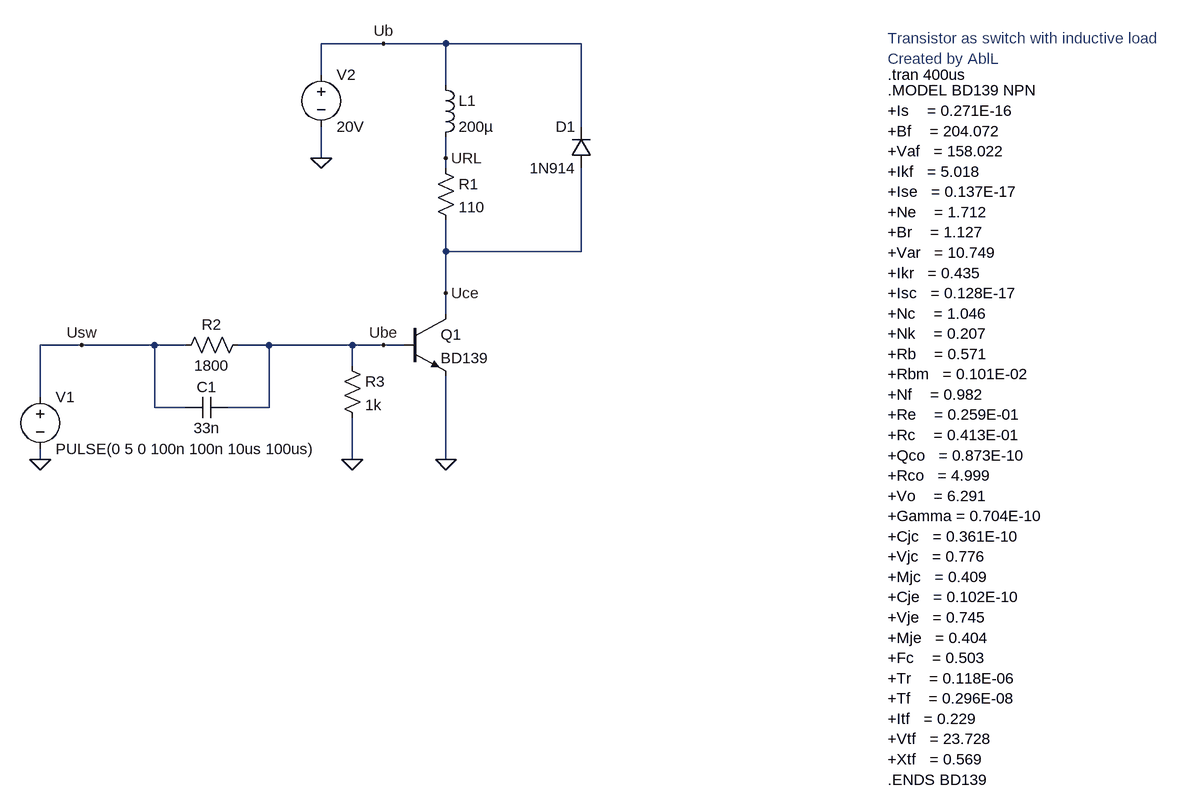
[diagram p0: schematic Transistor_Schalter_mit_ind_Last.asc]
Transistor_Schalter_mit_ind_Last.asc, the LTspice schematic file:
Version 4
SHEET 1 1312 880
WIRE 64 -160 -32 -160
WIRE 160 -160 64 -160
WIRE 368 -160 160 -160
WIRE -32 -112 -32 -160
WIRE 160 -96 160 -160
WIRE 368 -32 368 -160
WIRE -32 16 -32 -32
WIRE 160 16 160 -16
WIRE 160 32 160 16
WIRE 160 160 160 112
WIRE 368 160 368 32
WIRE 368 160 160 160
WIRE 160 224 160 160
WIRE 160 256 160 224
WIRE -400 304 -464 304
WIRE -288 304 -400 304
WIRE -240 304 -288 304
WIRE -112 304 -160 304
WIRE 16 304 -112 304
WIRE 64 304 16 304
WIRE 96 304 64 304
WIRE 16 336 16 304
WIRE -464 384 -464 304
WIRE -288 400 -288 304
WIRE -240 400 -288 400
WIRE -112 400 -112 304
WIRE -112 400 -176 400
WIRE -464 480 -464 464
WIRE 16 480 16 416
WIRE 160 480 160 352
FLAG -464 480 0
FLAG 160 480 0
FLAG -32 16 0
FLAG 160 224 Uce
FLAG 64 304 Ube
FLAG -400 304 Usw
FLAG 16 480 0
FLAG 64 -160 Ub
FLAG 160 16 URL
SYMBOL res 144 16 R0
SYMATTR InstName R1
SYMATTR Value 110
SYMBOL cap -176 384 R90
WINDOW 0 0 32 VBottom 2
WINDOW 3 32 32 VTop 2
SYMATTR InstName C1
SYMATTR Value 33n
SYMBOL res -144 288 R90
WINDOW 0 0 56 VBottom 2
WINDOW 3 32 56 VTop 2
SYMATTR InstName R2
SYMATTR Value 1800
SYMBOL voltage -464 368 R0
SYMATTR InstName V1
SYMATTR Value PULSE(0 5 0 100n 100n 10us 100us)
SYMBOL voltage -32 -128 R0
WINDOW 123 0 0 Left 0
WINDOW 39 0 0 Left 0
SYMATTR InstName V2
SYMATTR Value 20V
SYMBOL npn 96 256 R0
SYMATTR InstName Q1
SYMATTR Value BD139
SYMBOL ind 144 -112 R0
SYMATTR InstName L1
SYMATTR Value 200µ
SYMBOL diode 384 32 R180
WINDOW 0 24 64 Left 2
WINDOW 3 24 0 Left 2
SYMATTR InstName D1
SYMATTR Value 1N914
SYMBOL res 0 320 R0
SYMATTR InstName R3
SYMATTR Value 1k
TEXT 840 -88 Left 2 !.MODEL BD139 NPN\n+Is    = 0.271E-16\n+Bf    = 204.072\n+Vaf   = 158.022\n+Ikf   = 5.018\n+Ise   = 0.137E-17\n+Ne    = 1.712\n+Br    = 1.127\n+Var   = 10.749\n+Ikr   = 0.435\n+Isc   = 0.128E-17\n+Nc    = 1.046\n+Nk    = 0.207\n+Rb    = 0.571\n+Rbm   = 0.101E-02\n+Nf    = 0.982\n+Re    = 0.259E-01\n+Rc    = 0.413E-01\n+Qco   = 0.873E-10\n+Rco   = 4.999\n+Vo    = 6.291\n+Gamma = 0.704E-10\n+Cjc   = 0.361E-10\n+Vjc   = 0.776\n+Mjc   = 0.409\n+Cje   = 0.102E-10\n+Vje   = 0.745\n+Mje   = 0.404\n+Fc    = 0.503\n+Tr    = 0.118E-06\n+Tf    = 0.296E-08\n+Itf   = 0.229\n+Vtf   = 23.728\n+Xtf   = 0.569\n.ENDS BD139
TEXT 840 -168 Left 2 ;Transistor as switch with inductive load\nCreated by AblL
TEXT 840 -112 Left 2 !.tran 400us

The netlist it stands for:
* Transistor_Schalter_mit_ind_Last.asc
R1 URL Uce 110
C1 Ube Usw 33n
R2 Ube Usw 1800
V1 Usw 0 PULSE(0 5 0 100n 100n 10us 100us)
V2 Ub 0 20V
Q1 Uce Ube 0 0 BD139
L1 Ub URL 200µ
D1 Uce Ub 1N914
R3 Ube 0 1k
.model D D
.lib standard.dio
.model NPN NPN
.model PNP PNP
.lib standard.bjt
.MODEL BD139 NPN
+Is    = 0.271E-16
+Bf    = 204.072
+Vaf   = 158.022
+Ikf   = 5.018
+Ise   = 0.137E-17
+Ne    = 1.712
+Br    = 1.127
+Var   = 10.749
+Ikr   = 0.435
+Isc   = 0.128E-17
+Nc    = 1.046
+Nk    = 0.207
+Rb    = 0.571
+Rbm   = 0.101E-02
+Nf    = 0.982
+Re    = 0.259E-01
+Rc    = 0.413E-01
+Qco   = 0.873E-10
+Rco   = 4.999
+Vo    = 6.291
+Gamma = 0.704E-10
+Cjc   = 0.361E-10
+Vjc   = 0.776
+Mjc   = 0.409
+Cje   = 0.102E-10
+Vje   = 0.745
+Mje   = 0.404
+Fc    = 0.503
+Tr    = 0.118E-06
+Tf    = 0.296E-08
+Itf   = 0.229
+Vtf   = 23.728
+Xtf   = 0.569
.ENDS BD139
* Transistor as switch with inductive load
* Created by AblL
.tran 400us
.backanno
.end